# Altium schematic sheet gps_ublox.SchDoc
size 297 x 209 mm
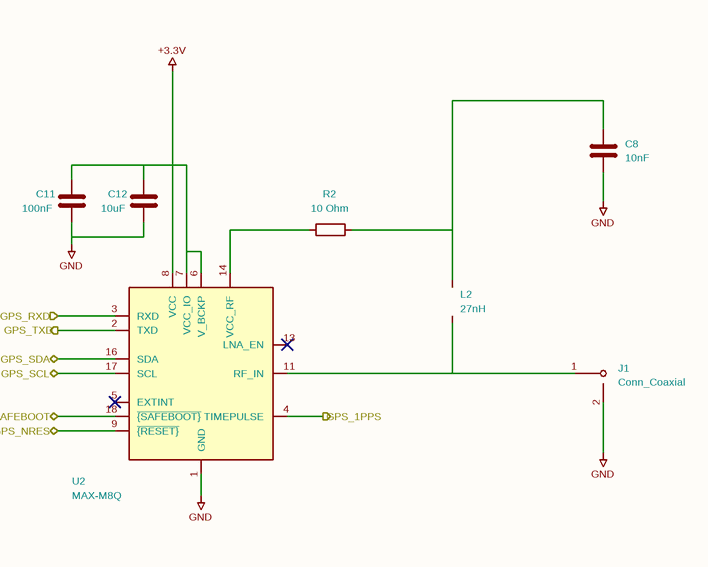
[diagram p0: gps_ublox.SchDoc]

## Parts
C8  10nF
C11  100nF
C12  10uF
J1  Conn_Coaxial
L2  27nH
R2  10 Ohm
U2  MAX-M8Q  [ublox_MAX]

## Ports
GPS_1PPS (out), GPS_NRES (bidir), GPS_NSAFEBOOT (bidir), GPS_RXD (in), GPS_SCL (bidir), GPS_SDA (bidir), GPS_TXD (out)

## Nets
+3.3V: C11.1 C12.1 U2.6(V_BCKP) U2.7(VCC_IO) U2.8(VCC)
GND: C8.2 C11.2 C12.2 J1.2(Ext) U2.1(GND)
GPS_1PPS: U2.4(TIMEPULSE) ; port GPS_1PPS
GPS_NRES: U2.9(~{{RESET}}) ; port GPS_NRES
GPS_NSAFEBOOT: U2.18(~{{SAFEBOOT}}) ; port GPS_NSAFEBOOT
GPS_RXD: U2.3(RXD) ; port GPS_RXD
GPS_SCL: U2.17(SCL) ; port GPS_SCL
GPS_SDA: U2.16(SDA) ; port GPS_SDA
GPS_TXD: U2.2(TXD) ; port GPS_TXD
NetC8_1: C8.1 L2.1 R2.2
NetJ1_1: J1.1(In) L2.2 U2.11(RF_IN)
NetR2_1: R2.1 U2.14(VCC_RF)

Not connected (* = marked no-connect by the designer): U2 5(EXTINT)* 10(GND) 12(GND) 13(LNA_EN)* 15(Reserved)

## Notes on the sheet
- 1
- 2
- 3
- 4
- 5
- 6
- A
- B
- C
- D
- Title:
- File: gps_ublox.kicad_sch
- Sheet: /
- KiCad E.D.A.  kicad (5.1.4)-1
- Size: A4
- Date:
- Rev:
- Id: 1/1

## Library data of the parts
C8 C11 C12 = C
  C8: Value: 10nF
  C11: Value: 100nF
  C12: Value: 10uF
L2 = L: Value: 27nH
R2 = R: Value: 10 Ohm
J1 = Conn_Coaxial: Value: Conn_Coaxial
U2 = MAX-M8Q: Value: MAX-M8Q; Footprint: RF_GPS:ublox_MAX